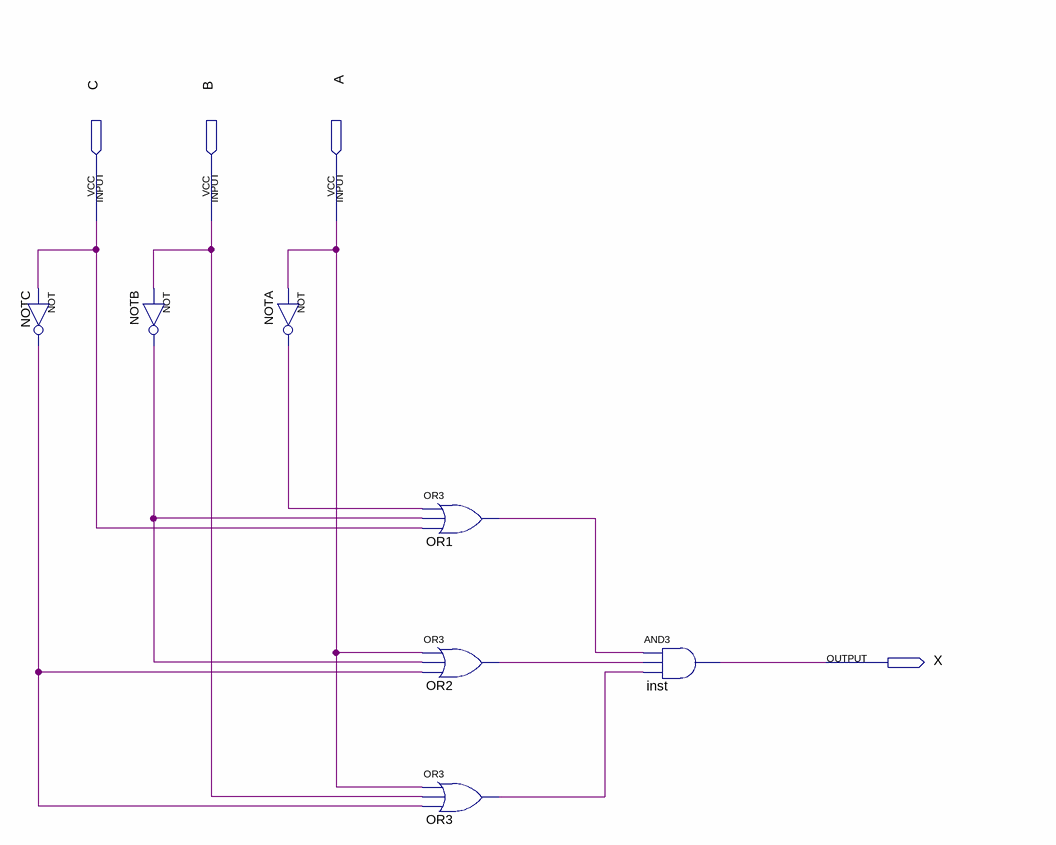
[diagram p0: schematic sheet]
// Quartus schematic Lab7.bdf as structural Verilog: 7 symbols, 4 pins
module Lab7 (
  input  C,
  input  B,
  input  A,
  output X
);

  wire NOTA_out, NOTB_out, NOTC_out, OR1_out, OR2_out, OR3_out;

  not NOTC (NOTC_out, C);
  not NOTB (NOTB_out, B);
  not NOTA (NOTA_out, A);
  or OR1 (OR1_out, NOTA_out, NOTB_out, C);
  or OR2 (OR2_out, A, NOTB_out, NOTC_out);
  or OR3 (OR3_out, A, B, NOTC_out);
  and inst (X, OR1_out, OR2_out, OR3_out);
endmodule
